# EAGLE design Board Nano (EAGLE 9.7.0)
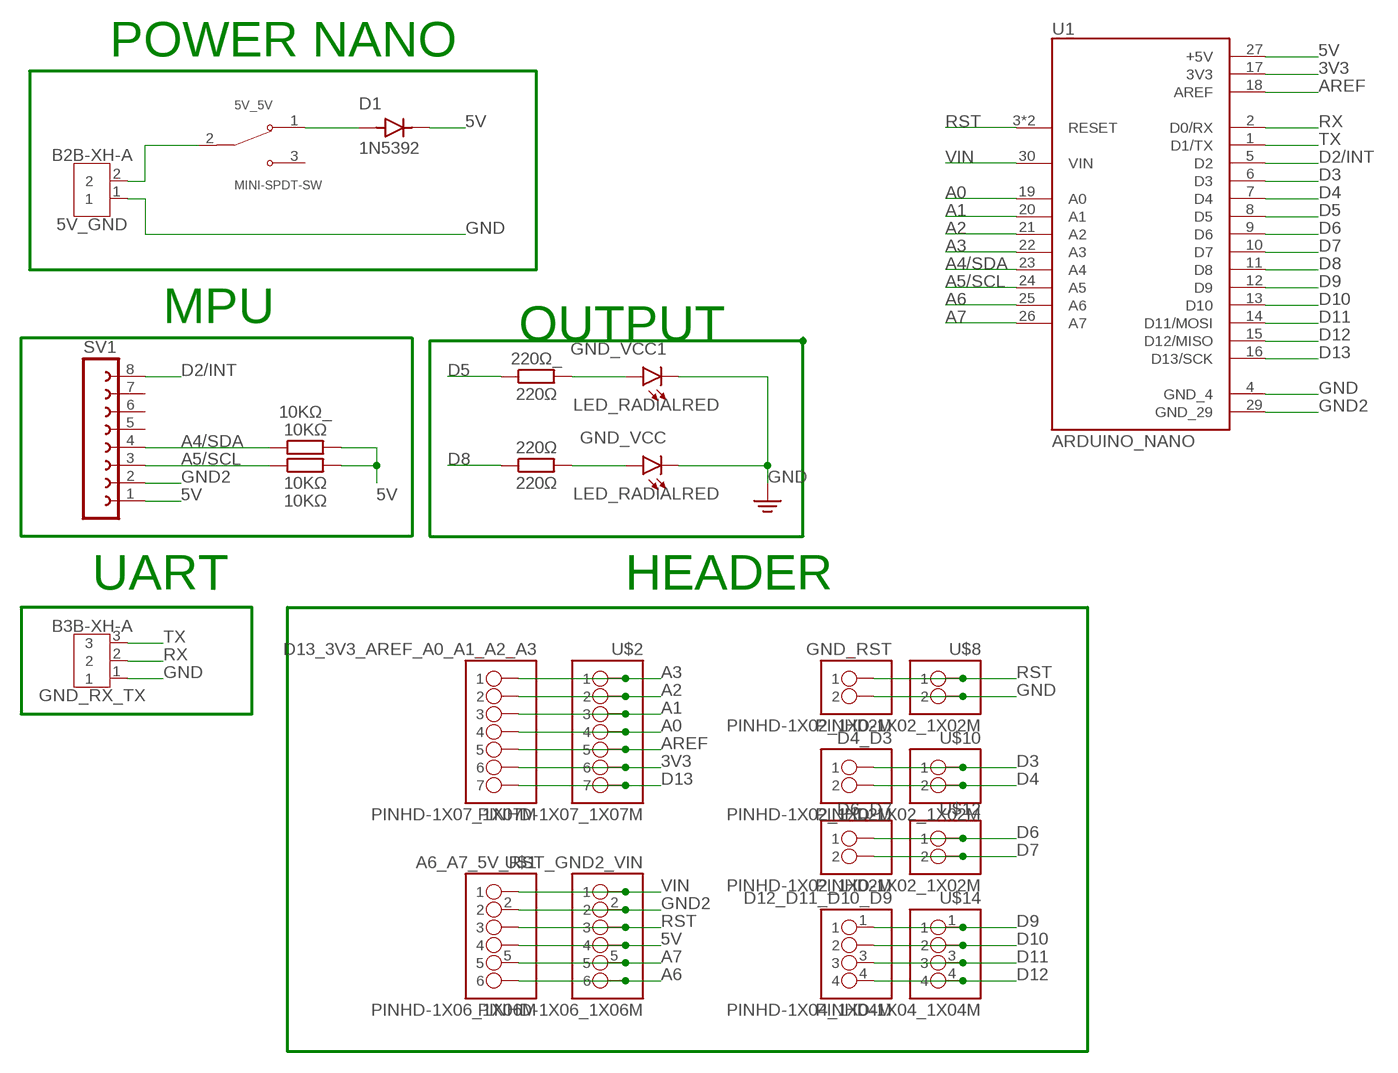
[diagram p0: schematic, sheet 1]

## Parts
5V_5V  MINI-SPDT-SW  [SW_MINI-SPDT-SW]
5V_GND  B2B-XH-A  [B2B-XH-A]
10KΩ  10KΩ  R_AXIAL-11.7MM-PITCH  [RESAD1176W63L850D250B]
10KΩ_  10KΩ  R_AXIAL-11.7MM-PITCH  [RESAD1176W63L850D250B]
220Ω  220Ω  R_AXIAL-11.7MM-PITCH  [RESAD1176W63L850D250B]
220Ω_  220Ω  R_AXIAL-11.7MM-PITCH  [RESAD1176W63L850D250B]
A6_A7_5V_RST_GND2_VIN  PINHD-1X06_1X06M  [1X06]
D1  1N5392  [DIOAD1300W80L670D310]
D4_D3  PINHD-1X02_1X02M  [1X02]
D6_D7  PINHD-1X02_1X02M  [1X02]
D12_D11_D10_D9  PINHD-1X04_1X04M  [1X04]
D13_3V3_AREF_A0_A1_A2_A3  PINHD-1X07_1X07M  [1X07]
GND_RST  PINHD-1X02_1X02M  [1X02]
GND_RX_TX  B3B-XH-A  [B3B-XH-A]
GND_VCC  LED_RADIALRED  [LEDRD254W60D565H860B_R]
GND_VCC1  LED_RADIALRED  [LEDRD254W60D565H860B_R]
SV1  FE08-1  [FE08]
U1  ARDUINO_NANO  [MODULE_ARDUINO_NANO]
U$1  PINHD-1X06_1X06M  [1X06]
U$2  PINHD-1X07_1X07M  [1X07]
U$8  PINHD-1X02_1X02M  [1X02]
U$10  PINHD-1X02_1X02M  [1X02]
U$12  PINHD-1X02_1X02M  [1X02]
U$14  PINHD-1X04_1X04M  [1X04]

## Nets
3V3: D13_3V3_AREF_A0_A1_A2_A3.6 U1.17(3V3) U$2.6
5V: 10KΩ.2 10KΩ_.2 A6_A7_5V_RST_GND2_VIN.4 D1.C(K) SV1.1 U1.27(+5V) U$1.4
5V_FB: 5V_5V.2 5V_GND.2
A0: D13_3V3_AREF_A0_A1_A2_A3.4 U1.19(A0) U$2.4
A1: D13_3V3_AREF_A0_A1_A2_A3.3 U1.20(A1) U$2.3
A2: D13_3V3_AREF_A0_A1_A2_A3.2 U1.21(A2) U$2.2
A3: D13_3V3_AREF_A0_A1_A2_A3.1 U1.22(A3) U$2.1
A4/SDA: 10KΩ_.1 SV1.4 U1.23(A4)
A5/SCL: 10KΩ.1 SV1.3 U1.24(A5)
A6: A6_A7_5V_RST_GND2_VIN.6 U1.25(A6) U$1.6
A7: A6_A7_5V_RST_GND2_VIN.5 U1.26(A7) U$1.5
AREF: D13_3V3_AREF_A0_A1_A2_A3.5 U1.18(AREF) U$2.5
D2/INT: SV1.8 U1.5(D2)
D3: D4_D3.1 U1.6(D3) U$10.1
D4: D4_D3.2 U1.7(D4) U$10.2
D5: 220Ω_.1 U1.8(D5)
D6: D6_D7.1 U1.9(D6) U$12.1
D7: D6_D7.2 U1.10(D7) U$12.2
D8: 220Ω.1 U1.11(D8)
D9: D12_D11_D10_D9.1 U1.12(D9) U$14.1
D10: D12_D11_D10_D9.2 U1.13(D10) U$14.2
D11: D12_D11_D10_D9.3 U1.14(D11/MOSI) U$14.3
D12: D12_D11_D10_D9.4 U1.15(D12/MISO) U$14.4
D13: D13_3V3_AREF_A0_A1_A2_A3.7 U1.16(D13/SCK) U$2.7
GND: 5V_GND.1 GND_RST.2 GND_RX_TX.1 GND_VCC1.C GND_VCC.C U1.4(GND_4) U$8.2
GND2: A6_A7_5V_RST_GND2_VIN.2 SV1.2 U1.29(GND_29) U$1.2
N$1: 220Ω_.2 GND_VCC1.A
N$2: 220Ω.2 GND_VCC.A
N$4: 5V_5V.1 D1.A
RST: A6_A7_5V_RST_GND2_VIN.3 GND_RST.1 U1.3(RESET) U1.28(RESET) U$1.3 U$8.1
RX: GND_RX_TX.2 U1.2(D0/RX)
TX: GND_RX_TX.3 U1.1(D1/TX)
VIN: A6_A7_5V_RST_GND2_VIN.1 U1.30(VIN) U$1.1
Unconnected: 5V_5V.3 SV1.5 SV1.6 SV1.7

## Notes on the sheet
- POWER NANO
- MPU
- OUTPUT
- UART | HEADER

## Library data of the parts
5V_5V = MINI-SPDT-SW:MINI-SPDT-SW: Simple breadboard friendly SPDT slide switch. Rated at 30V/200mA with operating force of 250 +/-100gf. Check availability <https://pricing.snapeda.com/parts/MINI-SPDT-SW/Gravitech/view-part?ref=eda>; AVAILABILITY: Not in stock; CHECK_PRICES: https://www.snapeda.com/parts/MINI-SPDT-SW/Gravitech/view-part/?ref=eda; DESCRIPTION: Slide Switches MINI SPDT SWITCH; MF: Gravitech; MP: MINI-SPDT-SW; PACKAGE: None; PRICE: None; SNAPEDA_LINK: https://www.snapeda.com/parts/MINI-SPDT-SW/Gravitech/view-part/?ref=snap
5V_GND = Connector:B2B-XH-A: XH Connector Top Entry - 2POS Details see: Datasheet <http://www.jst-mfg.com/product/pdf/eng/eXH.pdf>; CATEGORY: Header; DATASHEET: https://www.jst-mfg.com/product/pdf/eng/eXH.pdf?67404de0bbae1; DESCRIPTION: Connector Header Through Hole 2 position 0.098" (2.50mm); MANUFACTURER: JST Sales America Inc.; MPN: B2B-XH-A; OPERATING_TEMPERATURE: -25°C ~ 85°C; PACKAGE_SIZE: NA; PACKAGE_TYPE: THT; PART_STATUS: ACTIVE; PITCH: 0.098" (2.50mm); ROHS: COMPLIANT; SERIES: XH; SUBCATEGORY: Rectangular Connectors; TYPE: Header-Male Pin-Board to Cable/Wire-Through Hole
10KΩ 10KΩ_ 220Ω 220Ω_ = Resistor:R: Resistor Fixed - Generic; CATEGORY: Resistor; SUB-CATEGORY: Fixed
A6_A7_5V_RST_GND2_VIN U$1 = Tinkercad:PINHD-1X06
D1 = 1N5392:1N5392: Check availability <https://pricing.snapeda.com/parts/1N5392/ON%20Semiconductor/view-part?ref=eda>; AVAILABILITY: In Stock; CHECK_PRICES: https://www.snapeda.com/parts/1N5392/Onsemi/view-part/?ref=eda; DESCRIPTION: Diode Standard 100 V 1.5A Through Hole DO-15; MF: ON Semiconductor; MP: 1N5392; PACKAGE: None; PRICE: None; SNAPEDA_LINK: https://www.snapeda.com/parts/1N5392/Onsemi/view-part/?ref=snap
D4_D3 D6_D7 GND_RST U$8 U$10 U$12 = Tinkercad:PINHD-1X02
D12_D11_D10_D9 U$14 = Tinkercad:PINHD-1X04
D13_3V3_AREF_A0_A1_A2_A3 U$2 = Tinkercad:PINHD-1X07
GND_RX_TX = Connector:B3B-XH-A: XH Connector Top Entry - 3POS Details see: Datasheet <http://www.jst-mfg.com/product/pdf/eng/eXH.pdf>; CATEGORY: Header; DATASHEET: https://www.jst-mfg.com/product/pdf/eng/eXH.pdf?67404de0bbae1; DESCRIPTION: Connector Header Through Hole 3 position 0.098" (2.50mm); MANUFACTURER: JST Sales America Inc.; MPN: B3B-XH-A; OPERATING_TEMPERATURE: -25°C ~ 85°C; PACKAGE_SIZE: NA; PACKAGE_TYPE: THT; PART_STATUS: ACTIVE; PITCH: 0.098" (2.50mm); ROHS: COMPLIANT; SERIES: XH; SUBCATEGORY: Rectangular Connectors; TYPE: Header-Male Pin-Board to Cable/Wire-Through Hole
GND_VCC GND_VCC1 = Opto-Electronic:LED_RADIAL: LED - Generic
SV1 = con-lsta:FE08-1: FEMALE HEADER; OC_FARNELL: unknown; OC_NEWARK: unknown
U1 = ARDUINO_NANO:ARDUINO_NANO: Check availability <https://pricing.snapeda.com/parts/Arduino%20Nano/Arduino/view-part?ref=eda>; AVAILABILITY: Not in stock; CHECK_PRICES: https://www.snapeda.com/parts/Arduino%20Nano/Arduino/view-part/?ref=eda; DESCRIPTION: Small, complete, and breadboard-friendly board based on the ATmega328 (Arduino Nano 3.x); MF: Arduino; MP: Arduino Nano; PACKAGE: Non-Standard Arduino; PRICE: None; SNAPEDA_LINK: https://www.snapeda.com/parts/Arduino%20Nano/Arduino/view-part/?ref=snap

## Board
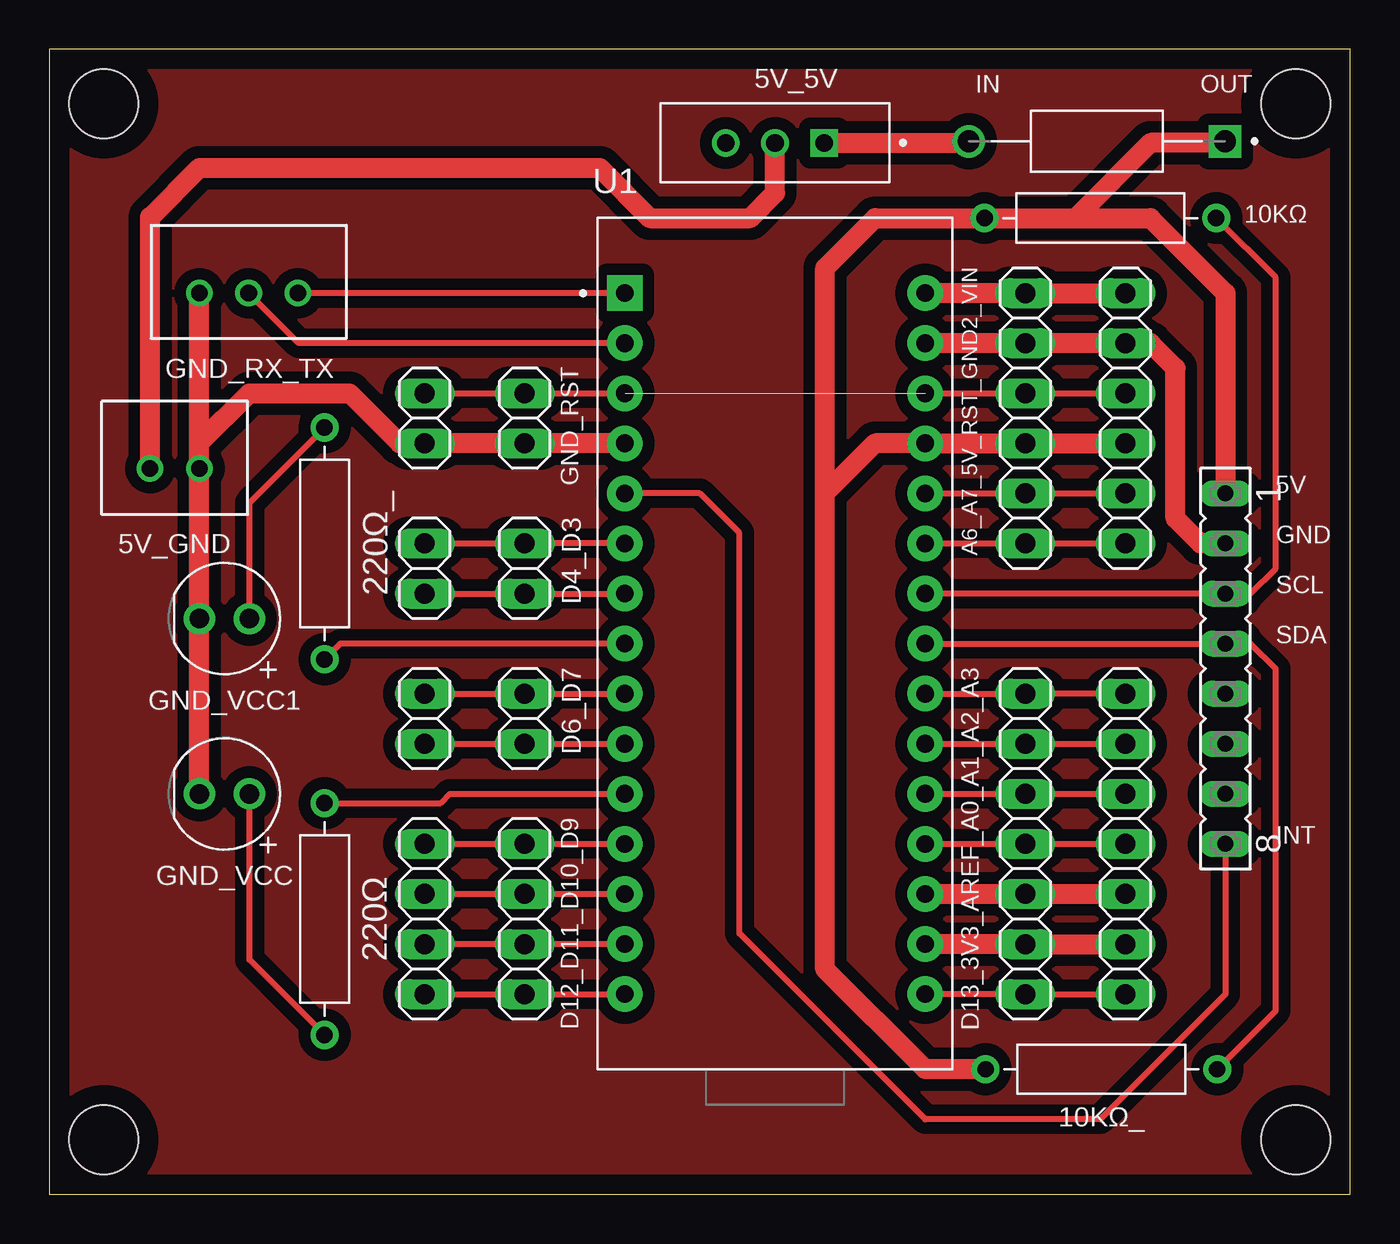
[diagram p1: board, top side]
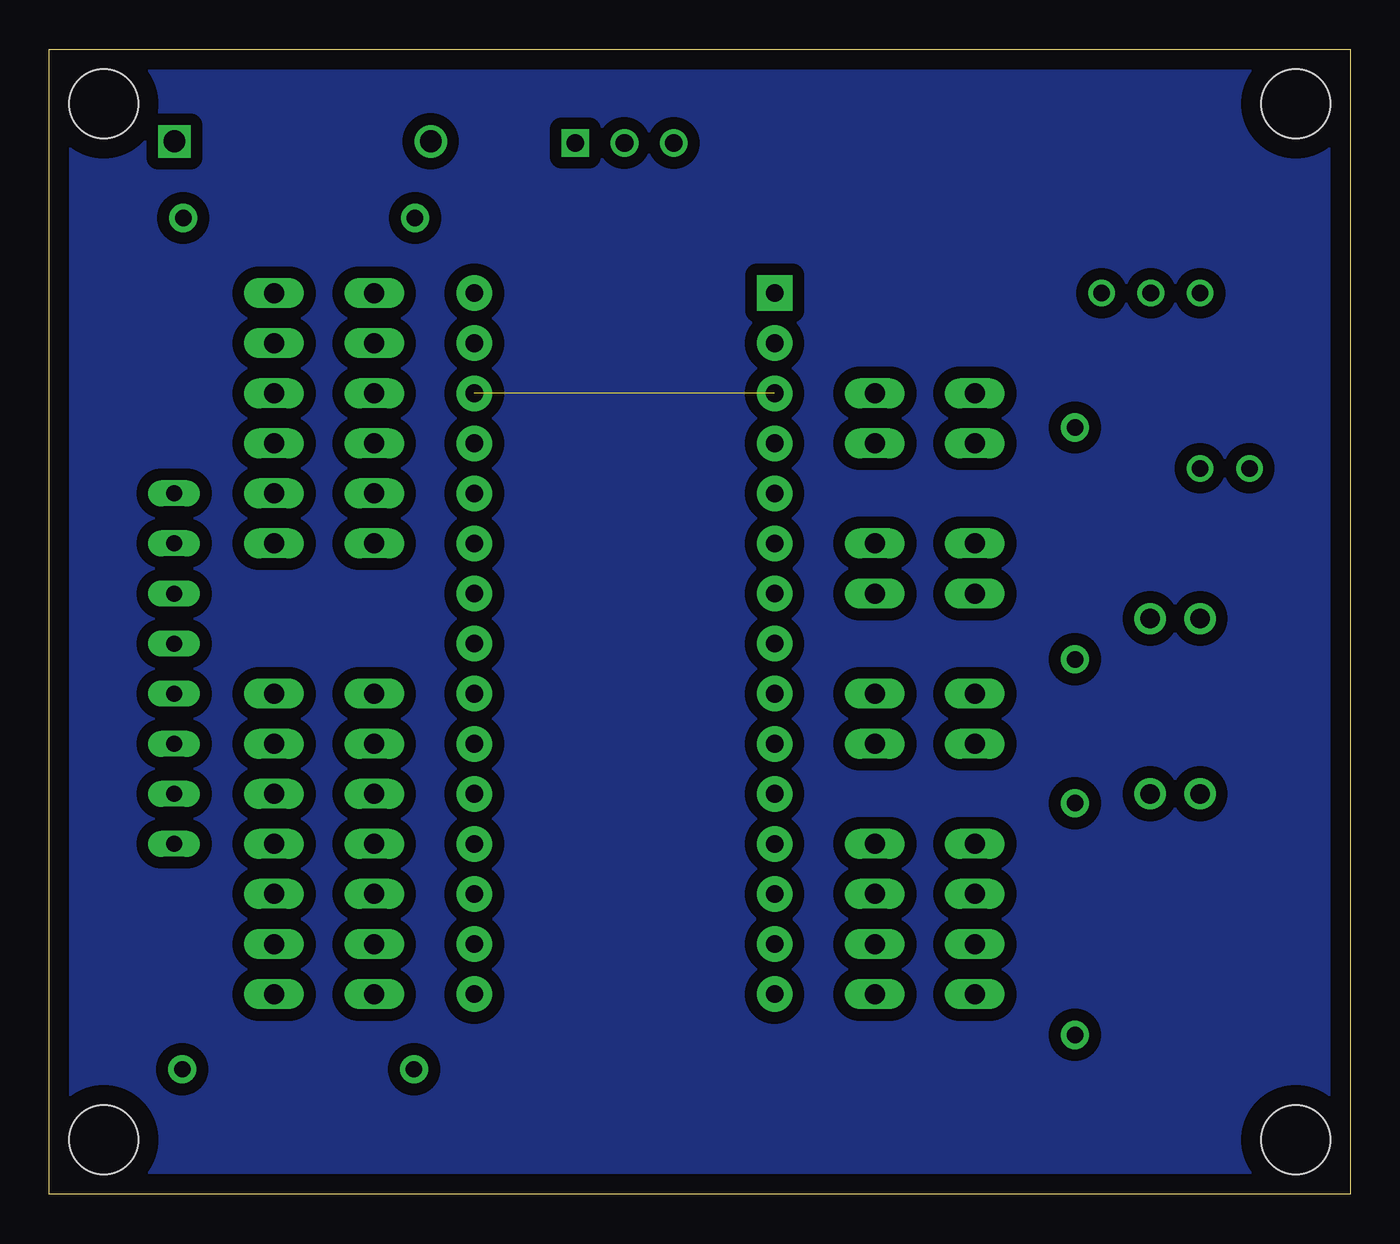
[diagram p2: board, bottom side, seen from below]

Size 66.02 x 58.09 mm. Coordinates in mm from the lower left corner, seen from the top.
Outline: 0,0 66.02,0 66.02,58.09 0,58.09 0,0
Copper layers (1*16): Top 0.035mm / dielectric 1.5mm / Bottom 0.035mm
Design rules "Fusion Electronics Design Rules": minimum track width 0.3mm, minimum drill 0.75mm, track to track 0.6mm, track to pad 0.25mm, pad to pad 0.25mm, via to via 6mil, smd to smd 6mil, copper to edge 40mil, drill to drill 0.6mm, minimum pad ring 10mil, minimum via ring 8mil, stop-mask expansion 4mil, vias tented up to drill 9999mil, thermal gap 10mil
Holes 3.5 mm at 63.25,55.32 2.77,55.32 2.77,2.77 63.25,2.77

### Footprints (pad centres in the part's own frame; a part is rotated, then mirrored left to right if it is on the bottom)
SW_MINI-SPDT-SW = drill 0.9 square: 1 -2.5,0 | drill 0.9: 2 0,0; 3 2.5,0
B2B-XH-A = drill 0.84: 1 0,0; 2 2.5,0
RESAD1176W63L850D250B = drill 0.83 pad 1.43: 1 -5.88,0; 2 5.88,0
1X06 = drill 1.016 long: 1 -6.35,0; 2 -3.81,0; 3 -1.27,0; 4 1.27,0; 5 3.81,0; 6 6.35,0
DIOAD1300W80L670D310 = drill 1.1: A 6.5,0 | drill 1.1 square: C -6.5,0
1X02 = drill 1.016 long: 1 -1.27,0; 2 1.27,0
1X04 = drill 1.016 long: 1 -3.81,0; 2 -1.27,0; 3 1.27,0; 4 3.81,0
1X07 = drill 1.016 long: 1 -7.62,0; 2 -5.08,0; 3 -2.54,0; 4 0,0; 5 2.54,0; 6 5.08,0; 7 7.62,0
B3B-XH-A = drill 0.84: 1 0,0; 2 2.5,0; 3 5,0
LEDRD254W60D565H860B_R = drill 0.981 pad 1.581: A -1.27,0; C 1.27,0
FE08 = drill 0.813 long: 1 -8.89,0; 2 -6.35,0; 3 -3.81,0; 4 -1.27,0; 5 1.27,0; 6 3.81,0; 7 6.35,0; 8 8.89,0
MODULE_ARDUINO_NANO = drill 0.9 pad 1.8 square: 1 -7.62,17.78 | drill 0.9 pad 1.8: 2 -7.62,15.24; 3 -7.62,12.7; 4 -7.62,10.16; 5 -7.62,7.62; 6 -7.62,5.08; 7 -7.62,2.54; 8 -7.62,0; 9 -7.62,-2.54; 10 -7.62,-5.08; 11 -7.62,-7.62; 12 -7.62,-10.16; 13 -7.62,-12.7; 14 -7.62,-15.24; 15 -7.62,-17.78; 16 7.62,-17.78; 17 7.62,-15.24; 18 7.62,-12.7; 19 7.62,-10.16; 20 7.62,-7.62; 21 7.62,-5.08; 22 7.62,-2.54; 23 7.62,0; 24 7.62,2.54; 25 7.62,5.08; 26 7.62,7.62; 27 7.62,10.16; 28 7.62,12.7; 29 7.62,15.24; 30 7.62,17.78

### Placement (x,y rotation side)
5V_5V  36.83,53.34 180 top
5V_GND  7.62,36.83 180 top
10KΩ  53.34,49.53 180 top
10KΩ_  53.39,6.35 180 top
220Ω  13.97,13.97 270 top
220Ω_  13.97,33.02 90 top
A6_A7_5V_RST_GND2_VIN  54.61,39.37 270 top
D1  53.16,53.42 180 top
D4_D3  24.13,31.75 270 top
D6_D7  24.13,24.13 270 top
D12_D11_D10_D9  24.13,13.97 270 top
D13_3V3_AREF_A0_A1_A2_A3  49.53,17.78 270 top
GND_RST  24.13,39.37 270 top
GND_RX_TX  7.62,45.72 0 top
GND_VCC  8.89,20.32 180 top
GND_VCC1  8.89,29.21 180 top
SV1  59.69,26.67 270 top
U1  36.83,27.94 0 top
U$1  49.53,39.37 270 top
U$2  54.61,17.78 270 top
U$8  19.05,39.37 270 top
U$10  19.05,31.75 270 top
U$12  19.05,24.13 270 top
U$14  19.05,13.97 270 top

### Tracks (layer width: path | path; a pad name or v marks a point on that pad's centre or on a via)
3V3
  Top 1.016: U1.17 D13_3V3_AREF_A0_A1_A2_A3.6 U$2.6
5V
  Top 1.016: 10KΩ_.2 44.45,6.35 39.37,11.43 39.37,35.56 | SV1.1 59.69,45.72 55.88,49.53 52.07,49.53 | 52.07,49.53 10KΩ.2 41.91,49.53 39.37,46.99 39.37,35.56 | 39.37,35.56 41.91,38.1 U1.27 U$1.4 A6_A7_5V_RST_GND2_VIN.4 | D1.C 59.58,53.34 55.88,53.34 52.07,49.53
5V_FB
  Top 1.016: 5V_GND.2 5.12,49.57 7.62,52.07 27.94,52.07 30.48,49.53 35.56,49.53 36.83,50.8 5V_5V.2
A0
  Top 0.305: U1.19 D13_3V3_AREF_A0_A1_A2_A3.4 U$2.4
A1
  Top 0.305: U1.20 D13_3V3_AREF_A0_A1_A2_A3.3 U$2.3
A2
  Top 0.305: U1.21 D13_3V3_AREF_A0_A1_A2_A3.2 U$2.2
A3
  Top 0.305: U1.22 D13_3V3_AREF_A0_A1_A2_A3.1 U$2.1
A4/SDA
  Top 0.305: U1.23 SV1.4 60.96,27.94 62.23,26.67 62.23,9.31 10KΩ_.1
A5/SCL
  Top 0.305: U1.24 SV1.3 60.96,30.48 62.23,31.75 62.23,46.52 10KΩ.1
A6
  Top 0.305: U1.25 U$1.6 A6_A7_5V_RST_GND2_VIN.6
A7
  Top 0.305: U1.26 U$1.5 A6_A7_5V_RST_GND2_VIN.5
AREF
  Top 1.016: U1.18 D13_3V3_AREF_A0_A1_A2_A3.5 U$2.5
D2/INT
  Top 0.305: U1.5 33.02,35.56 35.02,33.56 35.02,13.24 44.45,3.81 53.34,3.81 59.69,10.16 SV1.8
D3
  Top 0.305: U1.6 D4_D3.1 U$10.1
D4
  Top 0.305: U$10.2 D4_D3.2 U1.7
D5
  Top 0.305: U1.8 14.77,27.94 220Ω_.1
D6
  Top 0.305: U$12.1 D6_D7.1 U1.9
D7
  Top 0.305: U$12.2 D6_D7.2 U1.10
D8
  Top 0.305: 220Ω.1 19.85,19.85 20.32,20.32 U1.11
D9
  Top 0.305: U$14.1 D12_D11_D10_D9.1 U1.12
D10
  Top 0.305: U$14.2 D12_D11_D10_D9.2 U1.13
D11
  Top 0.305: U1.14 D12_D11_D10_D9.3 U$14.3
D12
  Top 0.305: U$14.4 D12_D11_D10_D9.4 U1.15
D13
  Top 0.305: U1.16 D13_3V3_AREF_A0_A1_A2_A3.7 U$2.7
GND
  Top 1.016: GND_VCC.C GND_VCC1.C 5V_GND.1 7.62,38.1 | 7.62,38.1 GND_RX_TX.1 | U1.4 GND_RST.2 U$8.2 17.78,38.1 15.24,40.64 10.16,40.64 7.62,38.1
GND2
  Top 1.016: SV1.2 58.42,33.02 57.15,34.29 57.15,41.91 55.88,43.18 A6_A7_5V_RST_GND2_VIN.2 U$1.2 U1.29
N$1
  Top 0.305: GND_VCC1.A 10.16,35.09 220Ω_.2
N$2
  Top 0.305: 220Ω.2 10.16,11.9 GND_VCC.A
N$4
  Top 1.016: 5V_5V.1 46.58,53.34 D1.A
RST  (1 unrouted)
  Top 0.305: U$8.1 GND_RST.1 U1.3 | U1.28 U$1.3 A6_A7_5V_RST_GND2_VIN.3
RX
  Top 0.3: GND_RX_TX.2 12.66,43.18 U1.2
TOP
  pour Top: 0.08,0.08 65.96,0.08 65.96,58.34 0.08,58.34
  pour Bottom: 0.08,0.08 65.96,0.08 65.96,58.34 0.08,58.34
TX
  Top 0.3: U1.1 GND_RX_TX.3
VIN
  Top 1.016: U1.30 U$1.1 A6_A7_5V_RST_GND2_VIN.1
(copper drawn outside any net)
  shapes: Top area x2

### Text on the board
tPlace: IN | OUT | 5V | GND | SCL | SDA | INT